# Altium project c2020.PrjPcb
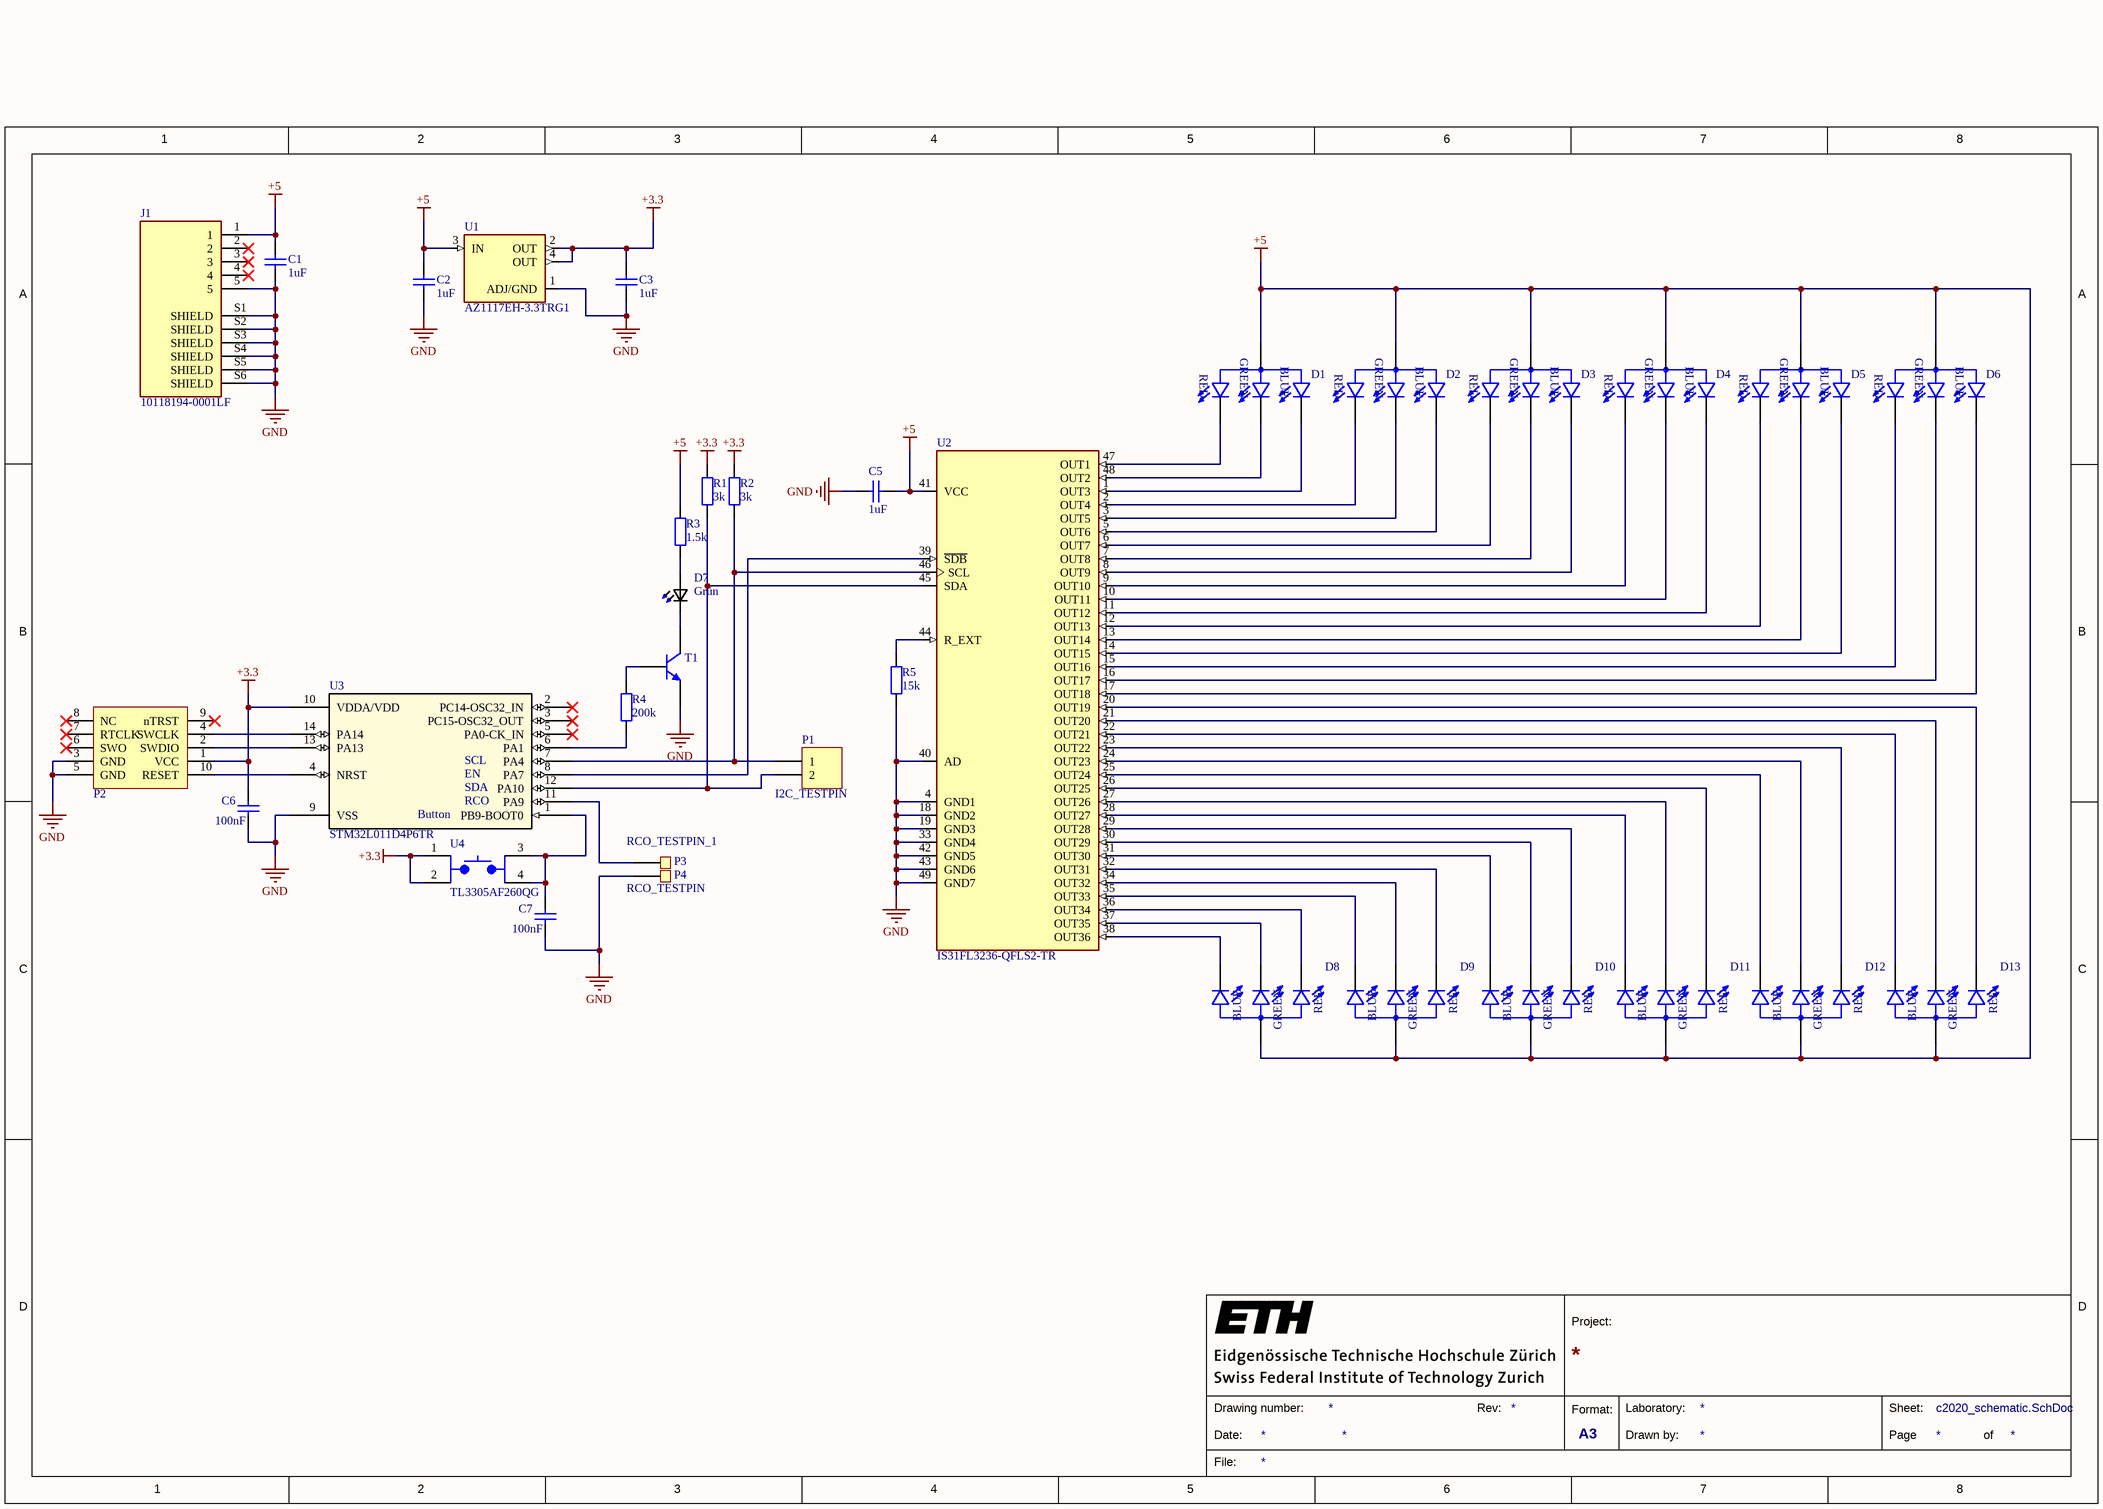
[diagram p0: c2020_schematic.SchDoc]
1 sheet, 34 parts. Net scope: global (net labels, ports and power ports of the same name join across sheets).
Board file: c2020_pcb.PcbDoc

## Sheet c2020_schematic.SchDoc
size A3

### Parts
C1  1uF  [CAP_0603i_1608m -N]
C2  1uF  [CAP_0603i_1608m -N]
C3  1uF  [CAP_0603i_1608m -N]
C5  1uF  [CAP_0603i_1608m -N]
C6  100nF  [CAP_0402i_1005m -N]
C7  100nF  [CAP_0402i_1005m -N]
D1  156120M173000  [LED_156120M173000]  (value not drawn)
D2  156120M173000  [LED_156120M173000]  (value not drawn)
D3  156120M173000  [LED_156120M173000]  (value not drawn)
D4  156120M173000  [LED_156120M173000]  (value not drawn)
D5  156120M173000  [LED_156120M173000]  (value not drawn)
D6  156120M173000  [LED_156120M173000]  (value not drawn)
D7  Grün  [*0603]
D8  156120M173000  [LED_156120M173000]  (value not drawn)
D9  156120M173000  [LED_156120M173000]  (value not drawn)
D10  156120M173000  [LED_156120M173000]  (value not drawn)
D11  156120M173000  [LED_156120M173000]  (value not drawn)
D12  156120M173000  [LED_156120M173000]  (value not drawn)
D13  156120M173000  [LED_156120M173000]  (value not drawn)
J1  10118194-0001LF  [AMPHENOL_10118194-0001LF]
P1  I2C_TESTPIN  [HDR1X2]
P2  Tag-Connect TC2050-IDC-NL-No pin assigned  [TAG-CONNECT TC2050-IDC-NL 10-Pin]  (value not drawn)
P3  RCO_TESTPIN_1  [Pad_0603]
P4  RCO_TESTPIN  [Pad_0603]
R1  3k  [RES_0402i_1005m -N]
R2  3k  [RES_0402i_1005m -N]
R3  1.5k  [RES_0402i_1005m -N]
R4  200k  [RES_0402i_1005m -N]
R5  15k  [RES_0402i_1005m -N]
T1  BJT NPN  [SOT23-N]  (value not drawn)
U1  AZ1117EH-3.3TRG1  [SOT230P700X180-4N]
U2  IS31FL3236-QFLS2-TR  [QFP50P900X900X160-48N]
U3  STM32L011D4P6TR  [TSSOP14]
U4  TL3305AF260QG  [SW_TL3305AF260QG]

### Nets
+3.3: C3.2 C6.2 P2.1(VCC) R1.2 R2.2 U1.2(OUT) U1.4(OUT) U3.10(VDDA/VDD) U4.1 U4.2
+5: C1.2 C2.2 C5.2 D1.1(A) D2.1(A) D3.1(A) D4.1(A) D5.1(A) D6.1(A) D8.1(A) D9.1(A) D10.1(A) D11.1(A) D12.1(A) D13.1(A) J1.1 R3.2 U1.3(IN) U2.41(VCC)
GND: C1.1 C2.1 C3.1 C5.1 C6.1 C7.1 J1.5 J1.S1(SHIELD) J1.S2(SHIELD) J1.S3(SHIELD) J1.S4(SHIELD) J1.S5(SHIELD) J1.S6(SHIELD) P2.3(GND) P2.5(GND) P4.1 R5.1 T1.2(E) U1.1(ADJ/GND) U2.4(GND1) U2.18(GND2) U2.19(GND3) U2.33(GND4) U2.40(AD) U2.42(GND5) U2.43(GND6) U2.49(GND7) U3.9(VSS)
NetC7_2: C7.2 U3.1(PB9-BOOT0) U4.3 U4.4
NetD1_2: D1.2(B_C) U2.1(OUT3)
NetD1_3: D1.3(R_C) U2.47(OUT1)
NetD1_4: D1.4(G_C) U2.48(OUT2)
NetD2_2: D2.2(B_C) U2.5(OUT6)
NetD2_3: D2.3(R_C) U2.2(OUT4)
NetD2_4: D2.4(G_C) U2.3(OUT5)
NetD3_2: D3.2(B_C) U2.8(OUT9)
NetD3_3: D3.3(R_C) U2.6(OUT7)
NetD3_4: D3.4(G_C) U2.7(OUT8)
NetD4_2: D4.2(B_C) U2.11(OUT12)
NetD4_3: D4.3(R_C) U2.9(OUT10)
NetD4_4: D4.4(G_C) U2.10(OUT11)
NetD5_2: D5.2(B_C) U2.14(OUT15)
NetD5_3: D5.3(R_C) U2.12(OUT13)
NetD5_4: D5.4(G_C) U2.13(OUT14)
NetD6_2: D6.2(B_C) U2.17(OUT18)
NetD6_3: D6.3(R_C) U2.15(OUT16)
NetD6_4: D6.4(G_C) U2.16(OUT17)
NetD7_1: D7.1(K2) T1.3(C)
NetD7_2: D7.2(A2) R3.1
NetD8_2: D8.2(B_C) U2.38(OUT36)
NetD8_3: D8.3(R_C) U2.36(OUT34)
NetD8_4: D8.4(G_C) U2.37(OUT35)
NetD9_2: D9.2(B_C) U2.35(OUT33)
NetD9_3: D9.3(R_C) U2.32(OUT31)
NetD9_4: D9.4(G_C) U2.34(OUT32)
NetD10_2: D10.2(B_C) U2.31(OUT30)
NetD10_3: D10.3(R_C) U2.29(OUT28)
NetD10_4: D10.4(G_C) U2.30(OUT29)
NetD11_2: D11.2(B_C) U2.28(OUT27)
NetD11_3: D11.3(R_C) U2.26(OUT25)
NetD11_4: D11.4(G_C) U2.27(OUT26)
NetD12_2: D12.2(B_C) U2.25(OUT24)
NetD12_3: D12.3(R_C) U2.23(OUT22)
NetD12_4: D12.4(G_C) U2.24(OUT23)
NetD13_2: D13.2(B_C) U2.22(OUT21)
NetD13_3: D13.3(R_C) U2.20(OUT19)
NetD13_4: D13.4(G_C) U2.21(OUT20)
NetP1_1: P1.1 R2.1 U2.46(SCL) U3.7(PA4)
NetP1_2: P1.2 R1.1 U2.45(SDA) U3.12(PA10)
NetP2_2: P2.2(SWDIO) U3.13(PA13)
NetP2_4: P2.4(SWCLK) U3.14(PA14)
NetP2_10: P2.10(RESET) U3.4(NRST)
NetP3_1: P3.1 U3.11(PA9)
NetR4_1: R4.1 U3.6(PA1)
NetR4_2: R4.2 T1.1(B)
NetR5_2: R5.2 U2.44(R_EXT)
NetU2_39: U2.39(~{SDB}) U3.8(PA7)

Not connected (* = marked no-connect by the designer): J1 2* 3* 4*; P2 6(SWO)* 7(RTCLK)* 8(NC)* 9(nTRST)*; U3 2(PC14-OSC32_IN)* 3(PC15-OSC32_OUT)* 5(PA0-CK_IN)*

### Notes on the sheet
- (near U3) SCL
- (near U3) EN
- (near U3) Button
- (near U3) SDA
- (near U3) RCO
- 1
- 2
- 3
- 4
- 5
- 6
- 7
- 8
- A
- B
- C
- D
- Project:
- Date:
- Drawing number:
- Rev:
- Format:
- A3
- Drawn by:
- Laboratory:
- Page
- Sheet:
- of
- File:
- (in symbol 156120M173000) RED; GREEN; BLUE

### Library data of the parts
C1-C3 C5-C7 = Cap: capacitor
D1-D6 D8-D13 = 156120M173000: Red, Green, Blue (RGB) 624nm Red, 525nm Green, 470nm Blue LED Indication - Discrete 2V Red, 3.3V Green, 3.3V Blue 1206 (3216 Metric); MF: Wurth Electronics; MP: 156120M173000; Package: 1206 Wurth Electronics Inc.; Purchase-URL: https://pricing.snapeda.com/search/part/156120M173000/?ref=eda; SnapEDA_Link: https://www.snapeda.com/parts/156120M173000/Wurth%20Electronics%20Inc./view-part/3623792/?ref=snap; Value: *; Check_prices: https://www.snapeda.com/parts/156120M173000/Wurth%20Electronics%20Inc./view-part/3623792/?ref=eda
D7 = LTST-C191KGKT: / LED; SMD; 0603; grün; 35mcd; 1.6x0.8x0.55mm; 130Â°; 2Ã·2.V; 20mA /; MF: Lite-On Inc.; Digi-Key_Purchase_URL: https://www.digikey.ch/product-detail/de/lite-on-inc/LTST-C191KGKT/160-1446-1-ND/386834; SnapEDA_Link: https://www.snapeda.com/parts/LTST-C191KFKT/Lite-On%20Inc./view-part/?ref=snap; MP: LTST-C191KGKT; Digi-Key_Part_Number: 160-1446-1-ND; Package: 0603 Lite-On; Value: *
J1 = 10118194-0001LF: USB - micro B USB 2.0 Receptacle Connector 5 Position Surface Mount, Right Angle; Through Hole; MF: Amphenol ICC; Package: None; Price: None; Availability: Unavailable; MP: 10118194-0001LF; SnapEDA_Link: https://www.snapeda.com/parts/10118194-0001LF/Amphenol%20FCI/view-part/1413308/?ref=snap; Value: *
P1 = Header 2: Header, 2-Pin
P2 = Tag-Connect TC2050-IDC-NL-No pin assigned: 10-pin pogo pin programing port
P3 P4 = Pad: Single Pad or Testpoint
R1-R5 = Res: Resistor
T1 = BJT NPN: NPN Bipolar Transistor; Note: Check footprint as it may  differ
U1 = AZ1117EH-3.3TRG1: Linear Voltage Regulator IC 1 Output 1A SOT-223; MF: Diodes Inc.; Package: SOT-223 Diodes Inc.; Value: *; Price: None; MP: AZ1117EH-3.3TRG1; SnapEDA_Link: https://www.snapeda.com/parts/AZ1117EH-3.3TRG1/Diodes%20Inc./view-part/482930/?ref=snap; Availability: Unavailable
U2 = IS31FL3236-QFLS2-TR: LED Driver IC 36 Output Linear IÂ²C Dimming 38mA 44-QFN (5x5); MF: ISSI, Integrated; Digi-Key_Part_Number: 706-1434-1-ND; Value: *; SnapEDA_Link: https://www.snapeda.com/parts/IS31FL3236-QFLS2-TR/ISSI,%20Integrated%20Silicon%20Solution%20Inc/view-part/328010/?ref=snap; Package: QFN-44 ISSI; MP: IS31FL3236-QFLS2-TR
U3 = STM32L011D4P6TR: No Description Available; SourceLibrary: STMicroelectronics_2020-10-07; Built_By: EMA_UL_Team; Vendor: STMicroelectronics; Copyright: Copyright (C) 2018 Accelerated Designs. All rights reserved; Manufacturer_Part_Number: STM32L011D4P6TR; RefDes: RefDes; Type: DEV
U4 = TL3305AF260QG: Tactile Switch SPST-NO Top Actuated Surface Mount; MF: E-Switch; Price: None; Value: *; MP: TL3305AF260QG; Package: LQFP-48 E-Switch; SnapEDA_Link: https://www.snapeda.com/parts/TL3305AF260QG/E-Switch/view-part/479903/?ref=snap; Availability: Unavailable